# EAGLE design PCB Sensor1&2 (EAGLE 7.1.0)
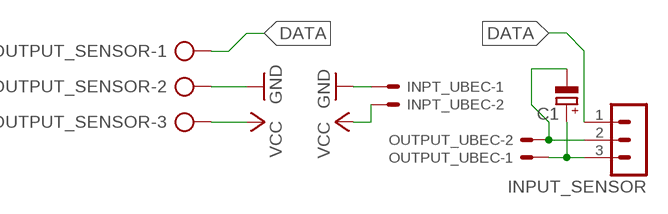
[diagram p0: schematic, sheet 1]

## Parts
C1  CPOL-EUE2-5  [E2-5]
INPT_UBEC  22-23-2021  [22-23-2021]
INPUT_SENSOR  MA03-1  [MA03-1]
OUTPUT_SENSOR  AK500/3  [AK500/3]
OUTPUT_UBEC  22-23-2021  [22-23-2021]

## Nets
DATA: INPUT_SENSOR.1 OUTPUT_SENSOR.1
GND: INPT_UBEC.1 OUTPUT_SENSOR.2
N$2: C1.- INPUT_SENSOR.2 OUTPUT_UBEC.2
N$3: C1.+ INPUT_SENSOR.3 OUTPUT_UBEC.1
VCC: INPT_UBEC.2 OUTPUT_SENSOR.3

## Library data of the parts
C1 = rcl:CPOL-EU: POLARIZED CAPACITOR, European symbol
INPT_UBEC OUTPUT_UBEC = con-molex:22-23-2021: .100" (2.54mm) Center Header - 2 Pin; MF: MOLEX; MPN: 22-23-2021; OC_FARNELL: 1462926; OC_NEWARK: 25C3832
INPUT_SENSOR = con-lstb:MA03-1: PIN HEADER; OC_FARNELL: unknown; OC_NEWARK: unknown
OUTPUT_SENSOR = con-ptr500:AK500/3: CONNECTOR; OC_FARNELL: unknown; OC_NEWARK: unknown

## Board
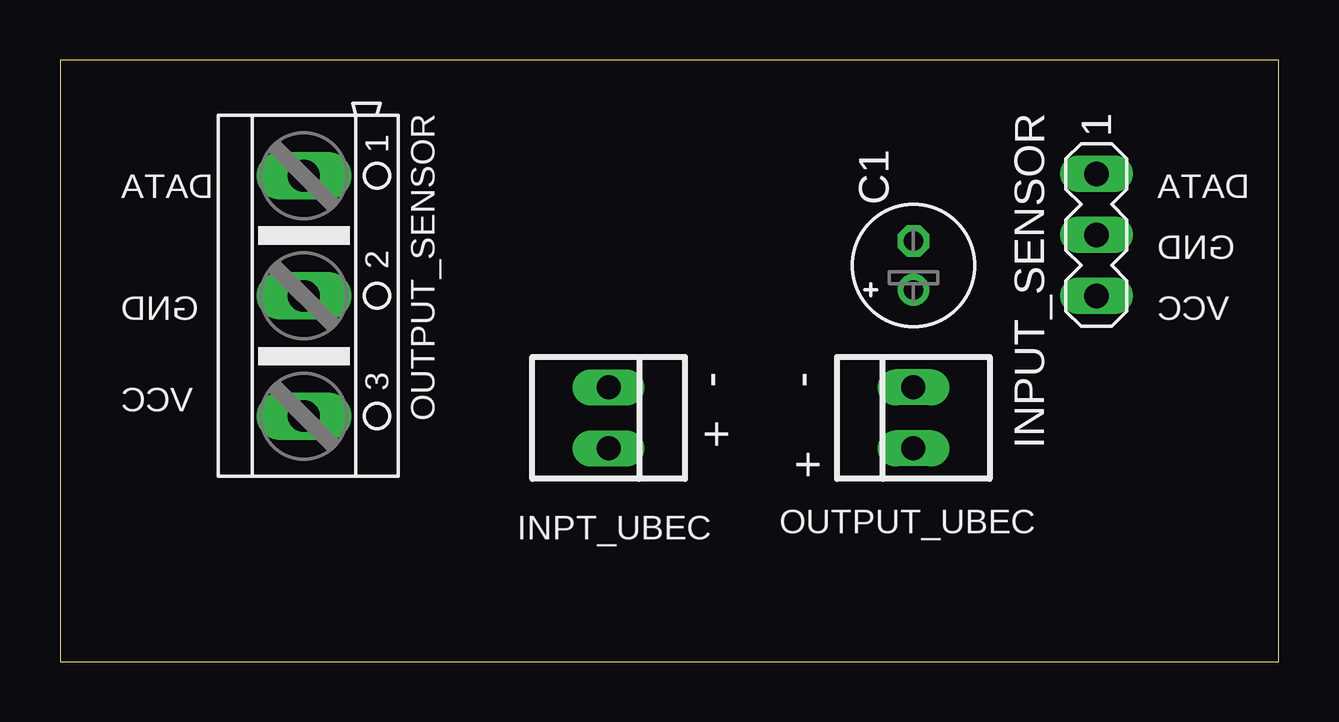
[diagram p1: board, top side]
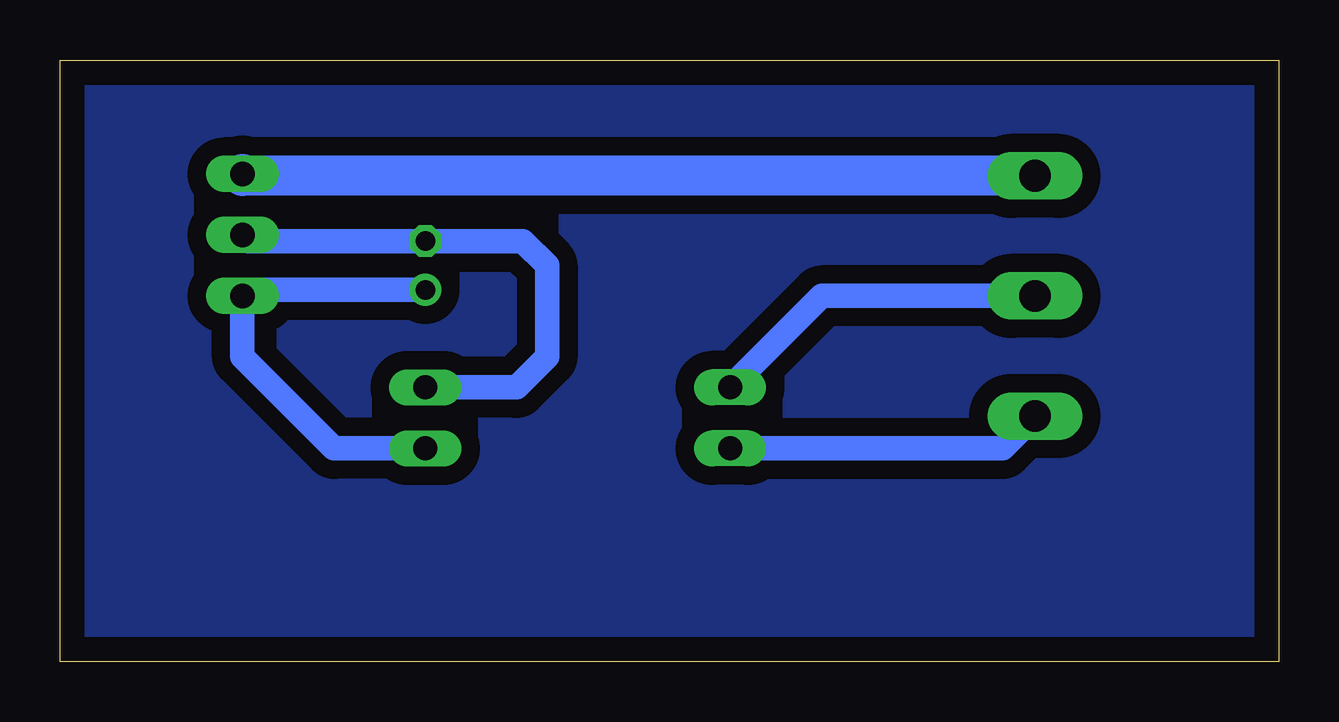
[diagram p2: board, bottom side, seen from below]

Size 50.78 x 25.07 mm. Coordinates in mm from the lower left corner, seen from the top.
Outline: 0,0 50.78,0 50.78,25.07 0,25.07 0,0
Copper layers (1*16): Top 0.035mm / dielectric 1.5mm / Bottom 0.035mm
Design rules "default *": minimum track width 10mil, minimum drill 24mil, track to track 30mil, track to pad 30mil, pad to pad 8mil, via to via 8mil, smd to smd 8mil, copper to edge 40mil, drill to drill 8mil, minimum pad ring 10mil, minimum via ring 8mil, stop-mask expansion 4mil, vias tented up to drill 0mil, thermal gap 10mil

### Footprints (pad centres in the part's own frame; a part is rotated, then mirrored left to right if it is on the bottom)
E2-5 = drill 0.813 pad 1.27: + -1.016,0 | drill 0.813 pad 1.27 octagon: - 1.016,0
22-23-2021 = drill 1 long: 1 -1.27,0; 2 1.27,0
MA03-1 = drill 1.016 long: 1 -2.54,0; 2 0,0; 3 2.54,0
AK500/3 = drill 1.321 long: 1 -5.004,0; 2 0,0; 3 5.004,0

### Placement (x,y rotation side)
C1  35.56,16.51 90 top
INPT_UBEC  22.86,10.16 270 top
INPUT_SENSOR  43.18,17.78 270 top
OUTPUT_SENSOR  10.16,15.24 270 top
OUTPUT_UBEC  35.56,10.16 90 top

### Tracks (layer width: path | path; a pad name or v marks a point on that pad's centre or on a via)
DATA
  Bottom 1.676: OUTPUT_SENSOR.1 43.18,20.24 INPUT_SENSOR.1
GND
  Bottom 1.016: OUTPUT_SENSOR.2 19.05,15.24 INPT_UBEC.1
N$2
  Bottom 1.016: INPUT_SENSOR.2 42.93,17.53 C1.- 31.5,17.53 30.48,16.51 30.48,12.7 31.75,11.43 OUTPUT_UBEC.2
N$3
  Bottom 1.016: OUTPUT_UBEC.1 39.37,8.89 43.18,12.7 INPUT_SENSOR.3 42.93,15.49 C1.+
N$4
  pour Bottom: 0,25.4 50.8,25.4 50.8,0 0,0
VCC
  Bottom 1.016: INPT_UBEC.2 11.51,8.89 OUTPUT_SENSOR.3

### Text on the board
tNames: DATA | DATA | GND | GND | VCC | VCC | - | - | + | +